# EAGLE design 2020can_slave_v2 (EAGLE 9.6.2)
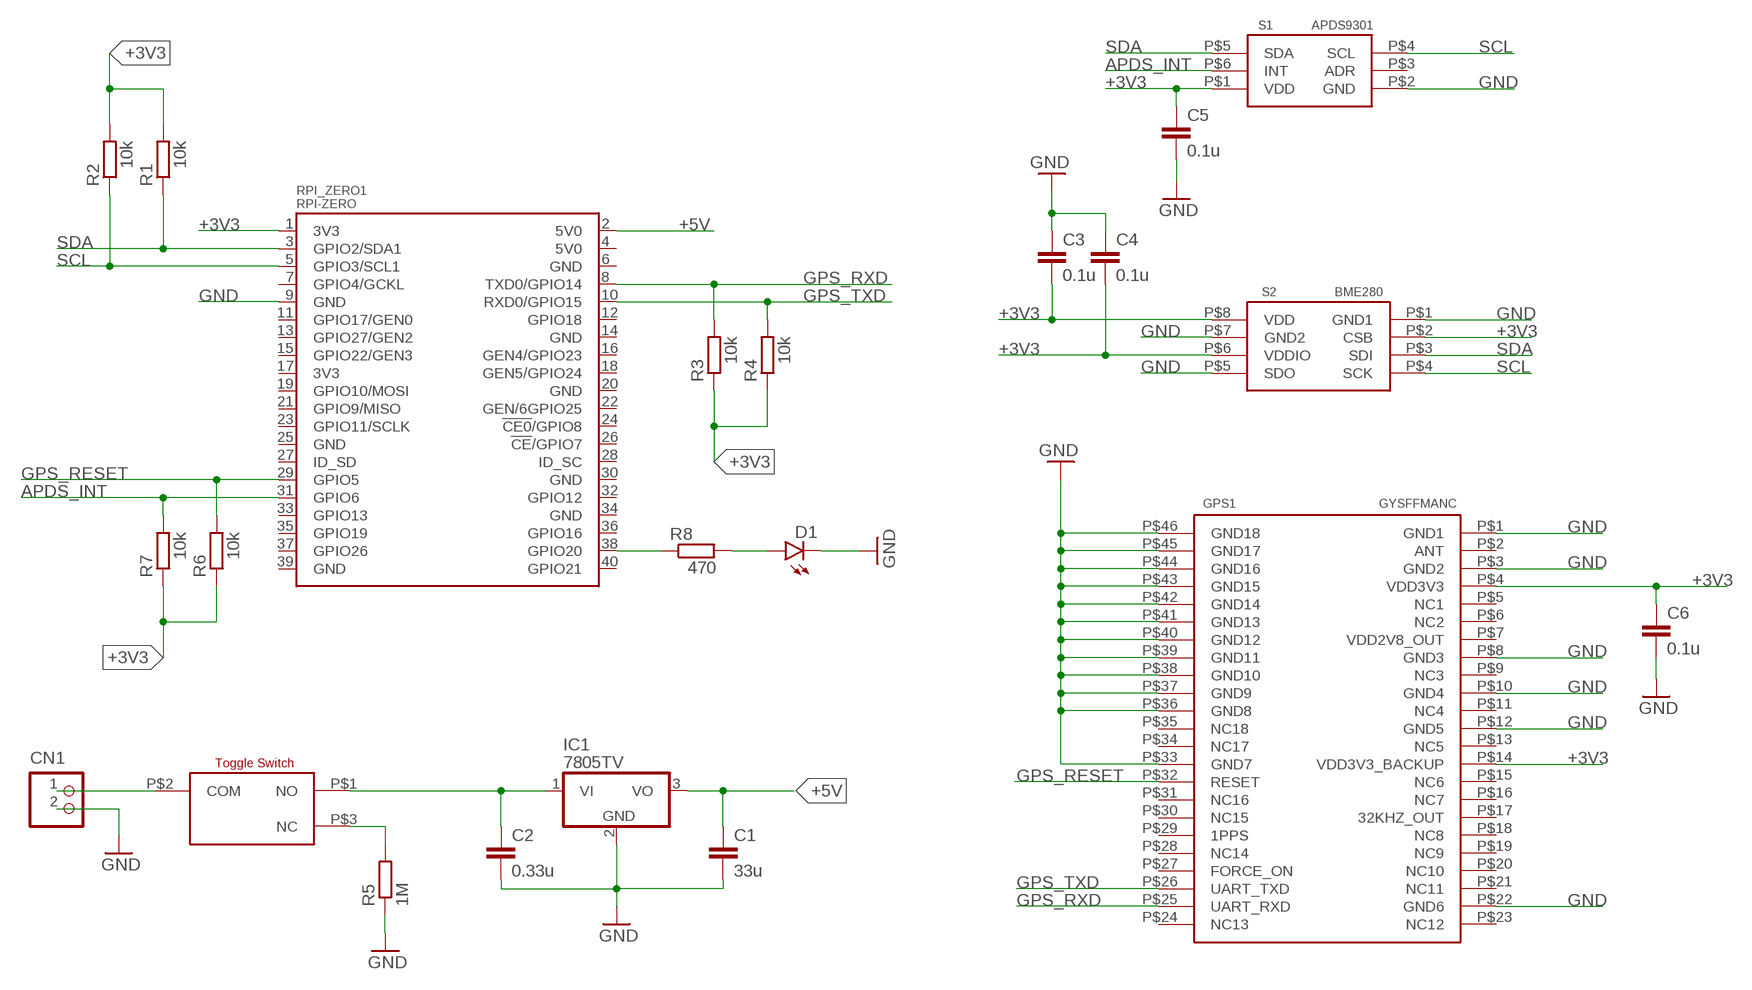
[diagram p0: schematic, sheet 1]

## Parts
C1  33u  C5/3  [C5B3]
C2  0.33u  C5/3  [C5B3]
C3  0.1u  C-EUC1206  [C1206]
C4  0.1u  C-EUC1206  [C1206]
C5  0.1u  C-EUC1206  [C1206]
C6  0.1u  C-EUC1206  [C1206]
CN1  B2P-VH  [B2P-VH]
D1  SFH482  [SFH482]
GPS1  GYSFFMANC  [GYSFFMANC]
IC1  7805TV  [TO220V]
R1  10k  R-EU_R1206  [R1206]
R2  10k  R-EU_R1206  [R1206]
R3  10k  R-EU_R1206  [R1206]
R4  10k  R-EU_R1206  [R1206]
R5  1M  R-EU_0207/10  [0207/10]
R6  10k  R-EU_R1206  [R1206]
R7  10k  R-EU_R1206  [R1206]
R8  470  R-EU_0207/10  [0207/10]
RPI_ZERO1  RPI-ZERO  [RASP_PI_ZERO_BOARD_FULL]
S1  APDS9301  [APDS9301]
S2  BME280  [BME280]
SWITCH_2MS1T2B4M2QES1  SWITCH_2MS1T2B4M2QES  [SWITCH_2MS1T2B4M2QES]

## Nets
+3V3: C3.2 C4.2 C5.1 C6.1 GPS1.P$4(VDD3V3) GPS1.P$14(VDD3V3_BACKUP) R1.2 R2.2 R3.1 R4.1 R6.1 R7.1 RPI_ZERO1.1(3V3) S1.P$1(VDD) S2.P$2(CSB) S2.P$6(VDDIO) S2.P$8(VDD)
+5V [supply]: C1.1 IC1.3(VO) RPI_ZERO1.2(5V0)
APDS_INT: R7.2 RPI_ZERO1.31(GPIO6) S1.P$6(INT)
GND [supply]: C1.2 C2.2 C3.1 C4.1 C5.2 C6.2 CN1.2 D1.K(C) GPS1.P$1(GND1) GPS1.P$3(GND2) GPS1.P$8(GND3) GPS1.P$10(GND4) GPS1.P$12(GND5) GPS1.P$22(GND6) GPS1.P$33(GND7) GPS1.P$36(GND8) GPS1.P$37(GND9) GPS1.P$38(GND10) GPS1.P$39(GND11) GPS1.P$40(GND12) GPS1.P$41(GND13) GPS1.P$42(GND14) GPS1.P$43(GND15) GPS1.P$44(GND16) GPS1.P$45(GND17) GPS1.P$46(GND18) IC1.2(GND) R5.1 RPI_ZERO1.9(GND) S1.P$2(GND) S2.P$1(GND1) S2.P$5(SDO) S2.P$7(GND2)
GPS_RESET: GPS1.P$32(RESET) R6.2 RPI_ZERO1.29(GPIO5)
GPS_RXD: GPS1.P$25(UART_RXD) R3.2 RPI_ZERO1.8(TXD0/GPIO14)
GPS_TXD: GPS1.P$26(UART_TXD) R4.2 RPI_ZERO1.10(RXD0/GPIO15)
N$1: R8.1 RPI_ZERO1.38(GPIO20)
N$2: D1.A R8.2
N$4: R5.2 SWITCH_2MS1T2B4M2QES1.P$3(NC)
SCL: R2.1 RPI_ZERO1.5(GPIO3/SCL1) S1.P$4(SCL) S2.P$4(SCK)
SDA: R1.1 RPI_ZERO1.3(GPIO2/SDA1) S1.P$5(SDA) S2.P$3(SDI)
V+ [supply]: CN1.1 SWITCH_2MS1T2B4M2QES1.P$2(COM)
VIN [supply]: C2.1 IC1.1(VI) SWITCH_2MS1T2B4M2QES1.P$1(NO)
Unconnected: GPS1.P$2(ANT) GPS1.P$5(NC1) GPS1.P$6(NC2) GPS1.P$7(VDD2V8_OUT) GPS1.P$9(NC3) GPS1.P$11(NC4) GPS1.P$13(NC5) GPS1.P$15(NC6) GPS1.P$16(NC7) GPS1.P$17(32KHZ_OUT) GPS1.P$18(NC8) GPS1.P$19(NC9) GPS1.P$20(NC10) GPS1.P$21(NC11) GPS1.P$23(NC12) GPS1.P$24(NC13) GPS1.P$27(FORCE_ON) GPS1.P$28(NC14) GPS1.P$29(1PPS) GPS1.P$30(NC15) GPS1.P$31(NC16) GPS1.P$34(NC17) GPS1.P$35(NC18) RPI_ZERO1.4(5V0) RPI_ZERO1.6(GND) RPI_ZERO1.7(GPIO4/GCKL) RPI_ZERO1.11(GPIO17/GEN0) RPI_ZERO1.12(GPIO18) RPI_ZERO1.13(GPIO27/GEN2) RPI_ZERO1.14(GND) RPI_ZERO1.15(GPIO22/GEN3) RPI_ZERO1.16(GEN4/GPIO23) RPI_ZERO1.17(3V3) RPI_ZERO1.18(GEN5/GPIO24) RPI_ZERO1.19(GPIO10/MOSI) RPI_ZERO1.20(GND) RPI_ZERO1.21(GPIO9/MISO) RPI_ZERO1.22(GEN/6GPIO25) RPI_ZERO1.23(GPIO11/SCLK) RPI_ZERO1.24(!CE0!/GPIO8) RPI_ZERO1.25(GND) RPI_ZERO1.26(!CE!/GPIO7) RPI_ZERO1.27(ID_SD) RPI_ZERO1.28(ID_SC) RPI_ZERO1.30(GND) RPI_ZERO1.32(GPIO12) RPI_ZERO1.33(GPIO13) RPI_ZERO1.34(GND) RPI_ZERO1.35(GPIO19) RPI_ZERO1.36(GPIO16) RPI_ZERO1.37(GPIO26) RPI_ZERO1.39(GND) RPI_ZERO1.40(GPIO21) S1.P$3(ADR)

## Library data of the parts
C1 C2 = capacitor-wima:C: CAPACITOR naming: grid - package width
C3-C6 = rcl:C-EU: CAPACITOR, European symbol; SPICEPREFIX: C
CN1 = CONN_VH:B2P-VH: Wire-to-Board 3.96mm pitch top mount connector Source: http://www.jst-mfg.com/product/pdf/jpn/VH.pdf http://www.jst-mfg.com/product/detail.php?series=262
D1 = led:SFH482: IR LED infrared emitting diode, Infineon
GPS1 = GPS:GYSFFMANC
IC1 = linear:78*: Positive VOLTAGE REGULATOR Source: http://cache.national.com/ds/LM/LM78L05.pdf http://www.fairchildsemi.com/ds/LM/LM7805.pdf
R1-R8 = rcl:R-EU_: RESISTOR, European symbol; SPICEPREFIX: R
RPI_ZERO1 = RaspberryPi_Zero:RPI-ZERO: MICON
S1 = APDS-9301:APDS9301
S2 = BME280:BME280
SWITCH_2MS1T2B4M2QES1 = switch_2MS1T2B4M2QES:SWITCH_2MS1T2B4M2QES

## Net classes
1 supply: width 1 mm, clearance 0.2 mm

## Board
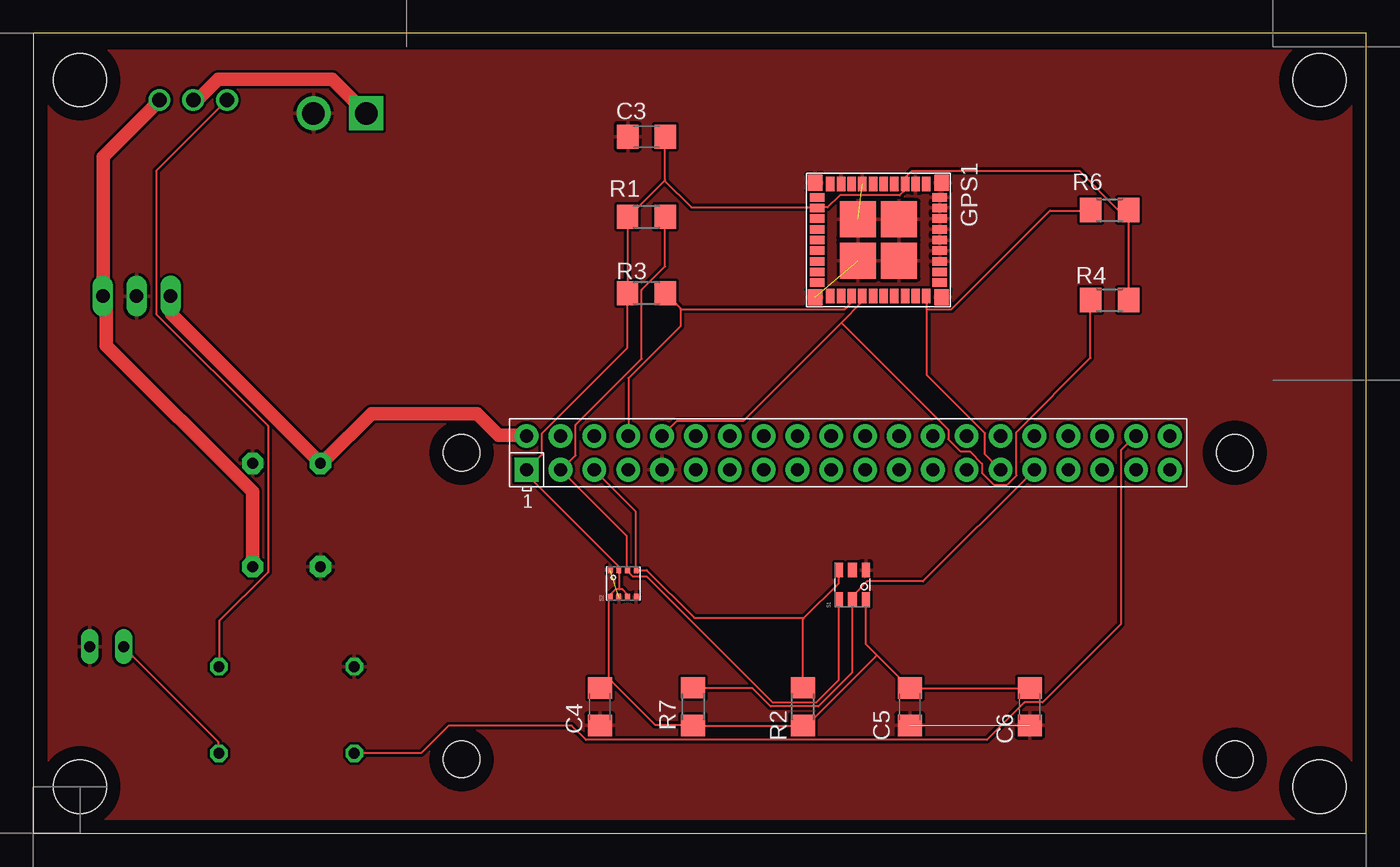
[diagram p1: board, top side]
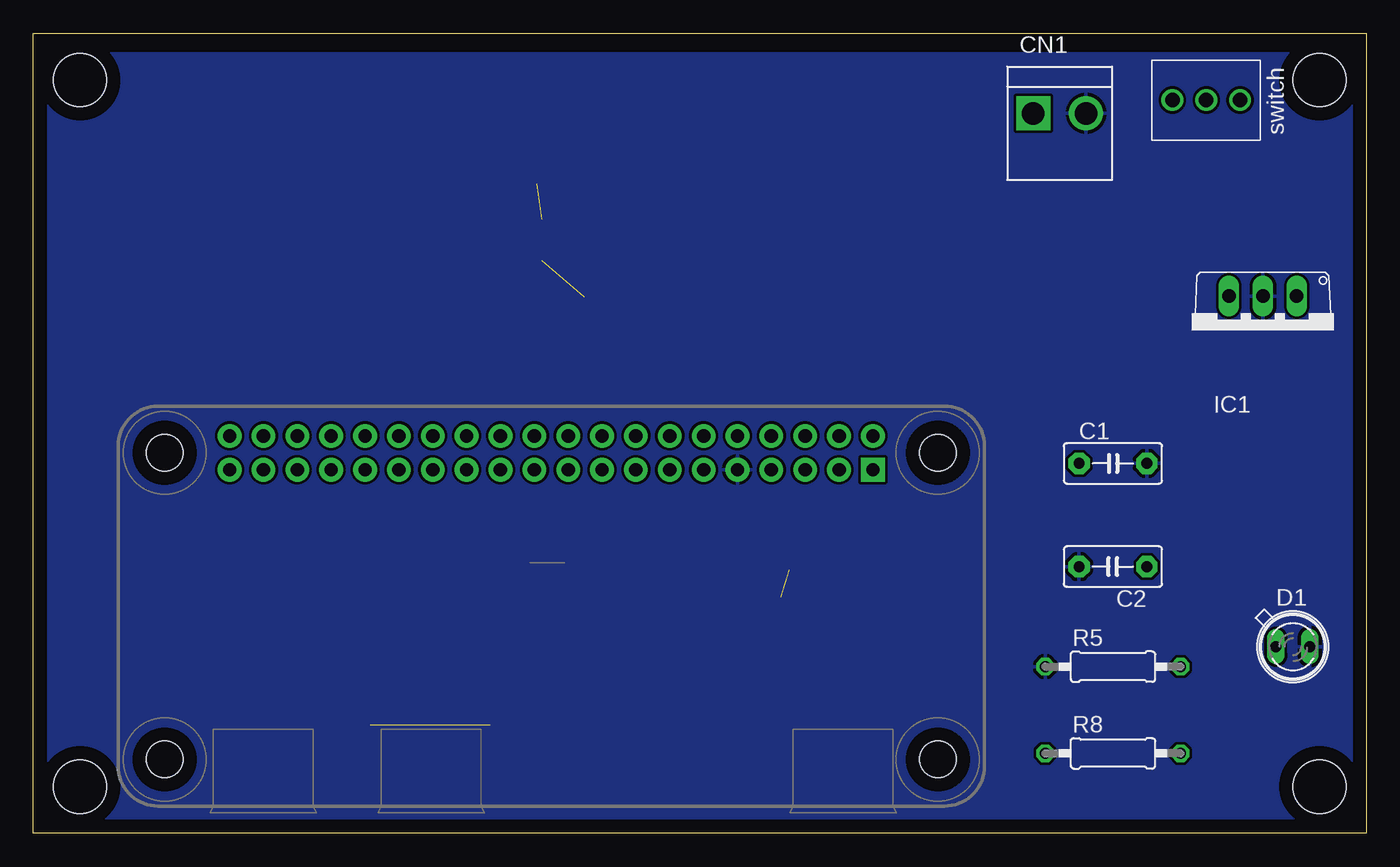
[diagram p2: board, bottom side, seen from below]

Size 100 x 60 mm. Coordinates in mm from the lower left corner, seen from the top.
Outline: 0,0 100,0 100,60 0,60 0,0
Copper layers (1*16): Top 0.035mm / dielectric 1.5mm / Bottom 0.035mm
Design rules "default": minimum track width 6mil, minimum drill 0.35mm, track to track 6mil, track to pad 6mil, pad to pad 6mil, via to via 6mil, smd to smd 6mil, copper to edge 40mil, drill to drill 6mil, minimum pad ring 10mil, minimum via ring 8mil, stop-mask expansion 4mil, vias tented up to drill 0mil, thermal gap 10mil
Holes 4 mm at 3.5,56.5 3.5,3.5 96.5,3.5 96.5,56.5
bKeepout: area 28,34 to 93,59

### Footprints (pad centres in the part's own frame; a part is rotated, then mirrored left to right if it is on the bottom)
C5B3 = drill 0.813 pad 1.6 octagon: 1 -2.54,0; 2 2.54,0
C1206 = smd 1.6 x 1.8: 1 -1.4,0; 2 1.4,0
B2P-VH = drill 1.7 square: 1 -1.98,0 | drill 1.7: 2 1.98,0
SFH482 = drill 0.813 long: A -1.27,0; K 1.27,0
GYSFFMANC = smd 1.2 x 1.1: P$1 0.7,10.15; P$12 0.7,0.65; P$22 9.3,0.65; P$33 9.3,10.15 | smd 1.1 x 0.635: P$2 0.8,9; P$3 0.8,8.2; P$4 0.8,7.4; P$5 0.8,6.6; P$6 0.8,5.8; P$7 0.8,5; P$8 0.8,4.2; P$9 0.8,3.4; P$10 0.8,2.6; P$11 0.8,1.8; P$23 9.2,1.8; P$24 9.2,2.6; P$25 9.2,3.4; P$26 9.2,4.2; P$27 9.2,5; P$28 9.2,5.8; P$29 9.2,6.6; P$30 9.2,7.4; P$31 9.2,8.2; P$32 9.2,9 | smd 0.635 x 1.1: P$13 1.8,0.8; P$14 2.6,0.8; P$15 3.4,0.8; P$16 4.2,0.8; P$17 5,0.8; P$18 5.8,0.8; P$19 6.6,0.8; P$20 7.4,0.8; P$21 8.2,0.8; P$34 8.2,10; P$35 7.4,10; P$36 6.6,10; P$37 5.8,10; P$38 5,10; P$39 4.2,10; P$40 3.4,10; P$41 2.6,10; P$42 1.8,10 | smd 2.7 x 2.7: P$43 3.45,6.95; P$44 3.45,3.85; P$45 6.55,3.85; P$46 6.55,6.95
TO220V = drill 1.016 long: 1 -2.54,-2.54; 2 0,-2.54; 3 2.54,-2.54
R1206 = smd 1.6 x 1.803: 1 -1.422,0; 2 1.422,0
0207/10 = drill 0.813 octagon: 1 -5.08,0; 2 5.08,0
RASP_PI_ZERO_BOARD_FULL = drill 1 pad 1.778 square: 1 8.37,25.23 | drill 1 pad 1.778: 2 8.37,27.77; 3 10.91,25.23; 4 10.91,27.77; 5 13.45,25.23; 6 13.45,27.77; 7 15.99,25.23; 8 15.99,27.77; 9 18.53,25.23; 10 18.53,27.77; 11 21.07,25.23; 12 21.07,27.77; 13 23.61,25.23; 14 23.61,27.77; 15 26.15,25.23; 16 26.15,27.77; 17 28.69,25.23; 18 28.69,27.77; 19 31.23,25.23; 20 31.23,27.77; 21 33.77,25.23; 22 33.77,27.77; 23 36.31,25.23; 24 36.31,27.77; 25 38.85,25.23; 26 38.85,27.77; 27 41.39,25.23; 28 41.39,27.77; 29 43.93,25.23; 30 43.93,27.77; 31 46.47,25.23; 32 46.47,27.77; 33 49.01,25.23; 34 49.01,27.77; 35 51.55,25.23; 36 51.55,27.77; 37 54.09,25.23; 38 54.09,27.77; 39 56.63,25.23; 40 56.63,27.77 | hole 2.75: 3.5,3.5; 3.5,26.5; 61.5,3.5; 61.5,26.5
APDS9301 = smd 1.1 x 0.6: P$1 0.55,0.3; P$2 2.75,0.3; P$4 2.75,2.3; P$5 0.55,2.3 | smd 1.1 x 0.7: P$3 2.75,1.3; P$6 0.55,1.3
BME280 = smd 0.5 x 0.35: P$1 2.275,2.225; P$2 2.275,1.575; P$3 2.275,0.925; P$4 2.275,0.275; P$5 0.225,0.275; P$6 0.225,0.925; P$7 0.225,1.575; P$8 0.225,2.225
SWITCH_2MS1T2B4M2QES = drill 1.09: P$1 0,2.54; P$2 0,0; P$3 0,-2.54

### Placement (x,y rotation side)
C1  19,27.75 0 bottom
C2  19,20 180 bottom
C3  46,52.25 0 top
C4  42.5,9.5 90 top
C5  65.75,9.5 270 top
C6  74.75,9.5 270 top
CN1  23,54 0 bottom
D1  5.5,14 0 bottom
GPS1  58,49.5 270 top
IC1  7.75,37.75 180 bottom
R1  46,46.25 180 top
R2  57.75,9.5 270 top
R3  46,40.5 0 top
R4  80.75,40 180 top
R5  19,12.5 0 bottom
R6  80.75,46.75 180 top
R7  49.5,9.5 90 top
R8  19,6 0 bottom
RPI_ZERO1  28.64,2.04 0 top
S1  62.75,17 90 top
S2  45.5,17.5 90 top
SWITCH_2MS1T2B4M2QES1  12,55 270 bottom

### Tracks (layer width: path | path; a pad name or v marks a point on that pad's centre or on a via)
+3V3
  Top 0.152: R4.1 82.14,40.01 82.14,46.71 R6.1 82.07,46.71 81.46,46.71 78.49,49.68 65.91,49.68 65.46,49.23 65.46,48.77 GPS1.P$4 65.38,48.69 65.38,48.23 65,47.85 60.5,47.85 59.59,46.94 58.83,46.94 GPS1.P$14 58.75,46.94 49.38,46.94 47.36,48.96 | 47.36,48.96 44.65,46.25 R1.2 44.58,46.18 44.58,40.54 R3.1 44.58,40.46 44.58,36.42 38.18,30.02 38.18,28.42 37.03,27.28 RPI_ZERO1.1 37.03,27.2 37.03,26.9 43.89,20.04 43.89,19.81 S2.P$2 43.97,19.74 43.97,18.29 | 47.36,48.96 47.4,49 47.4,52.2 C3.2 | 63.28,13.37 65.68,10.97 C5.1 74.68,10.9 C6.1 | 63.28,13.37 62.48,14.17 62.48,17.53 S1.P$1 | 63.28,13.37 58.06,8.15 57.76,8.15 R2.2 57.68,8.08 49.53,8.08 R7.1 49.45,8.15 46.63,8.15 43.2,11.58 C4.2 42.52,10.97 43.2,11.66 43.2,17.68 S2.P$8 43.28,17.75 43.28,17.91 43.66,18.29 43.97,18.29 | 43.97,18.29 44.2,18.29 44.5,17.98 44.5,17.75 S2.P$6
+5V
  Top 1: IC1.3 10.36,40.23 10.36,38.94 21.49,27.81 C1.1 21.95,28.04 25.38,31.47 33.3,31.47 34.9,29.87 36.96,29.87 RPI_ZERO1.2
APDS_INT
  Top 0.152: RPI_ZERO1.31 75.06,27.2 66.75,18.9 62.56,18.9 61.49,17.83 61.49,17.6 S1.P$6 61.42,17.53 61.42,12.04 58.9,9.53 55.32,9.53 53.95,10.9 49.53,10.9 R7.2
GND  (4 unrouted)
  pour Top: 1,58.75 99.25,58.75 99.25,0.75 1,0.75
  pour Bottom: 1.75,58.5 99,58.5 99,0.5 1,0.5 1,58.75
GPS_RESET
  Top 0.152: 67.06,39.32 67.06,34.37 71.4,30.02 71.4,28.42 72.54,27.28 RPI_ZERO1.29 | 67.06,39.32 67.06,40.23 GPS1.P$32 | 67.06,39.32 68.89,39.32 76.28,46.71 79.32,46.71 R6.2
GPS_RXD
  Top 0.152: 48.58,39.36 47.47,40.46 R3.2 | 48.58,39.36 48.62,39.32 60.88,39.32 61.34,39.78 61.34,40.23 GPS1.P$25 | RPI_ZERO1.8 44.65,29.87 44.65,34.14 48.54,38.02 48.54,39.32 48.58,39.36
GPS_TXD
  Top 0.152: 60.62,38.29 53.26,30.94 48.31,30.94 47.24,29.87 RPI_ZERO1.10 | 60.62,38.29 62.18,39.85 62.18,40.23 GPS1.P$26 | 60.62,38.29 68.66,30.25 68.66,29.57 69.57,28.65 70.26,28.65 71.17,27.74 71.17,27.05 72.08,26.14 73.08,26.14 73.76,26.82 73.76,30.1 79.32,35.66 79.32,39.93 R4.2
N$1
  Top 0.152: R8.1 24.16,6.02 29.11,6.02 31.17,8.08 40.39,8.08 41.45,7.01 71.55,7.01 74.37,9.83 75.74,9.83 81.61,15.7 81.61,28.73 82.68,29.79 RPI_ZERO1.38
N$2
  Top 0.152: R8.2 13.87,6.02 13.87,6.86 6.78,13.95 D1.A
N$4
  Top 0.152: R5.2 13.95,12.57 13.95,15.93 17.6,19.58 17.6,30.56 9.22,38.94 9.22,49.68 14.48,54.94 SWITCH_2MS1T2B4M2QES1.P$3
SCL
  Top 0.152: 57.8,16.12 57.76,16.08 57.76,10.97 R2.1 | 57.8,16.12 60.43,18.75 60.43,19.74 S1.P$4 | RPI_ZERO1.5 42.14,27.2 45.19,24.16 45.19,19.81 S2.P$4 45.26,19.74 46.02,19.74 49.61,16.15 57.76,16.15 57.8,16.12
SDA
  Top 0.152: S1.P$5 60.43,17.53 60.43,11.51 58.75,9.83 55.47,9.83 46.02,19.28 44.96,19.28 44.5,19.74 S2.P$3 44.5,19.81 44.5,22.33 39.62,27.2 RPI_ZERO1.3 39.62,27.28 40.69,28.35 40.69,30.63 45.64,35.59 45.64,40.77 47.4,42.52 47.4,46.18 R1.1
V+
  Top 1: SWITCH_2MS1T2B4M2QES1.P$2 12.04,55.02 12.34,55.02 13.87,56.54 22.4,56.54 24.92,54.03 CN1.1
VIN
  Top 1: SWITCH_2MS1T2B4M2QES1.P$1 9.45,54.94 5.26,50.75 5.26,40.31 IC1.1 5.49,39.85 5.49,36.58 16.46,25.6 16.46,20.04 C2.1